# Altium schematic sheet Output13-21.SchDoc
size 594 x 420 mm; SheetNumber: 8; SheetTotal: 10; Обозначение документа: QFP output13-21; Общее количество листов: 10
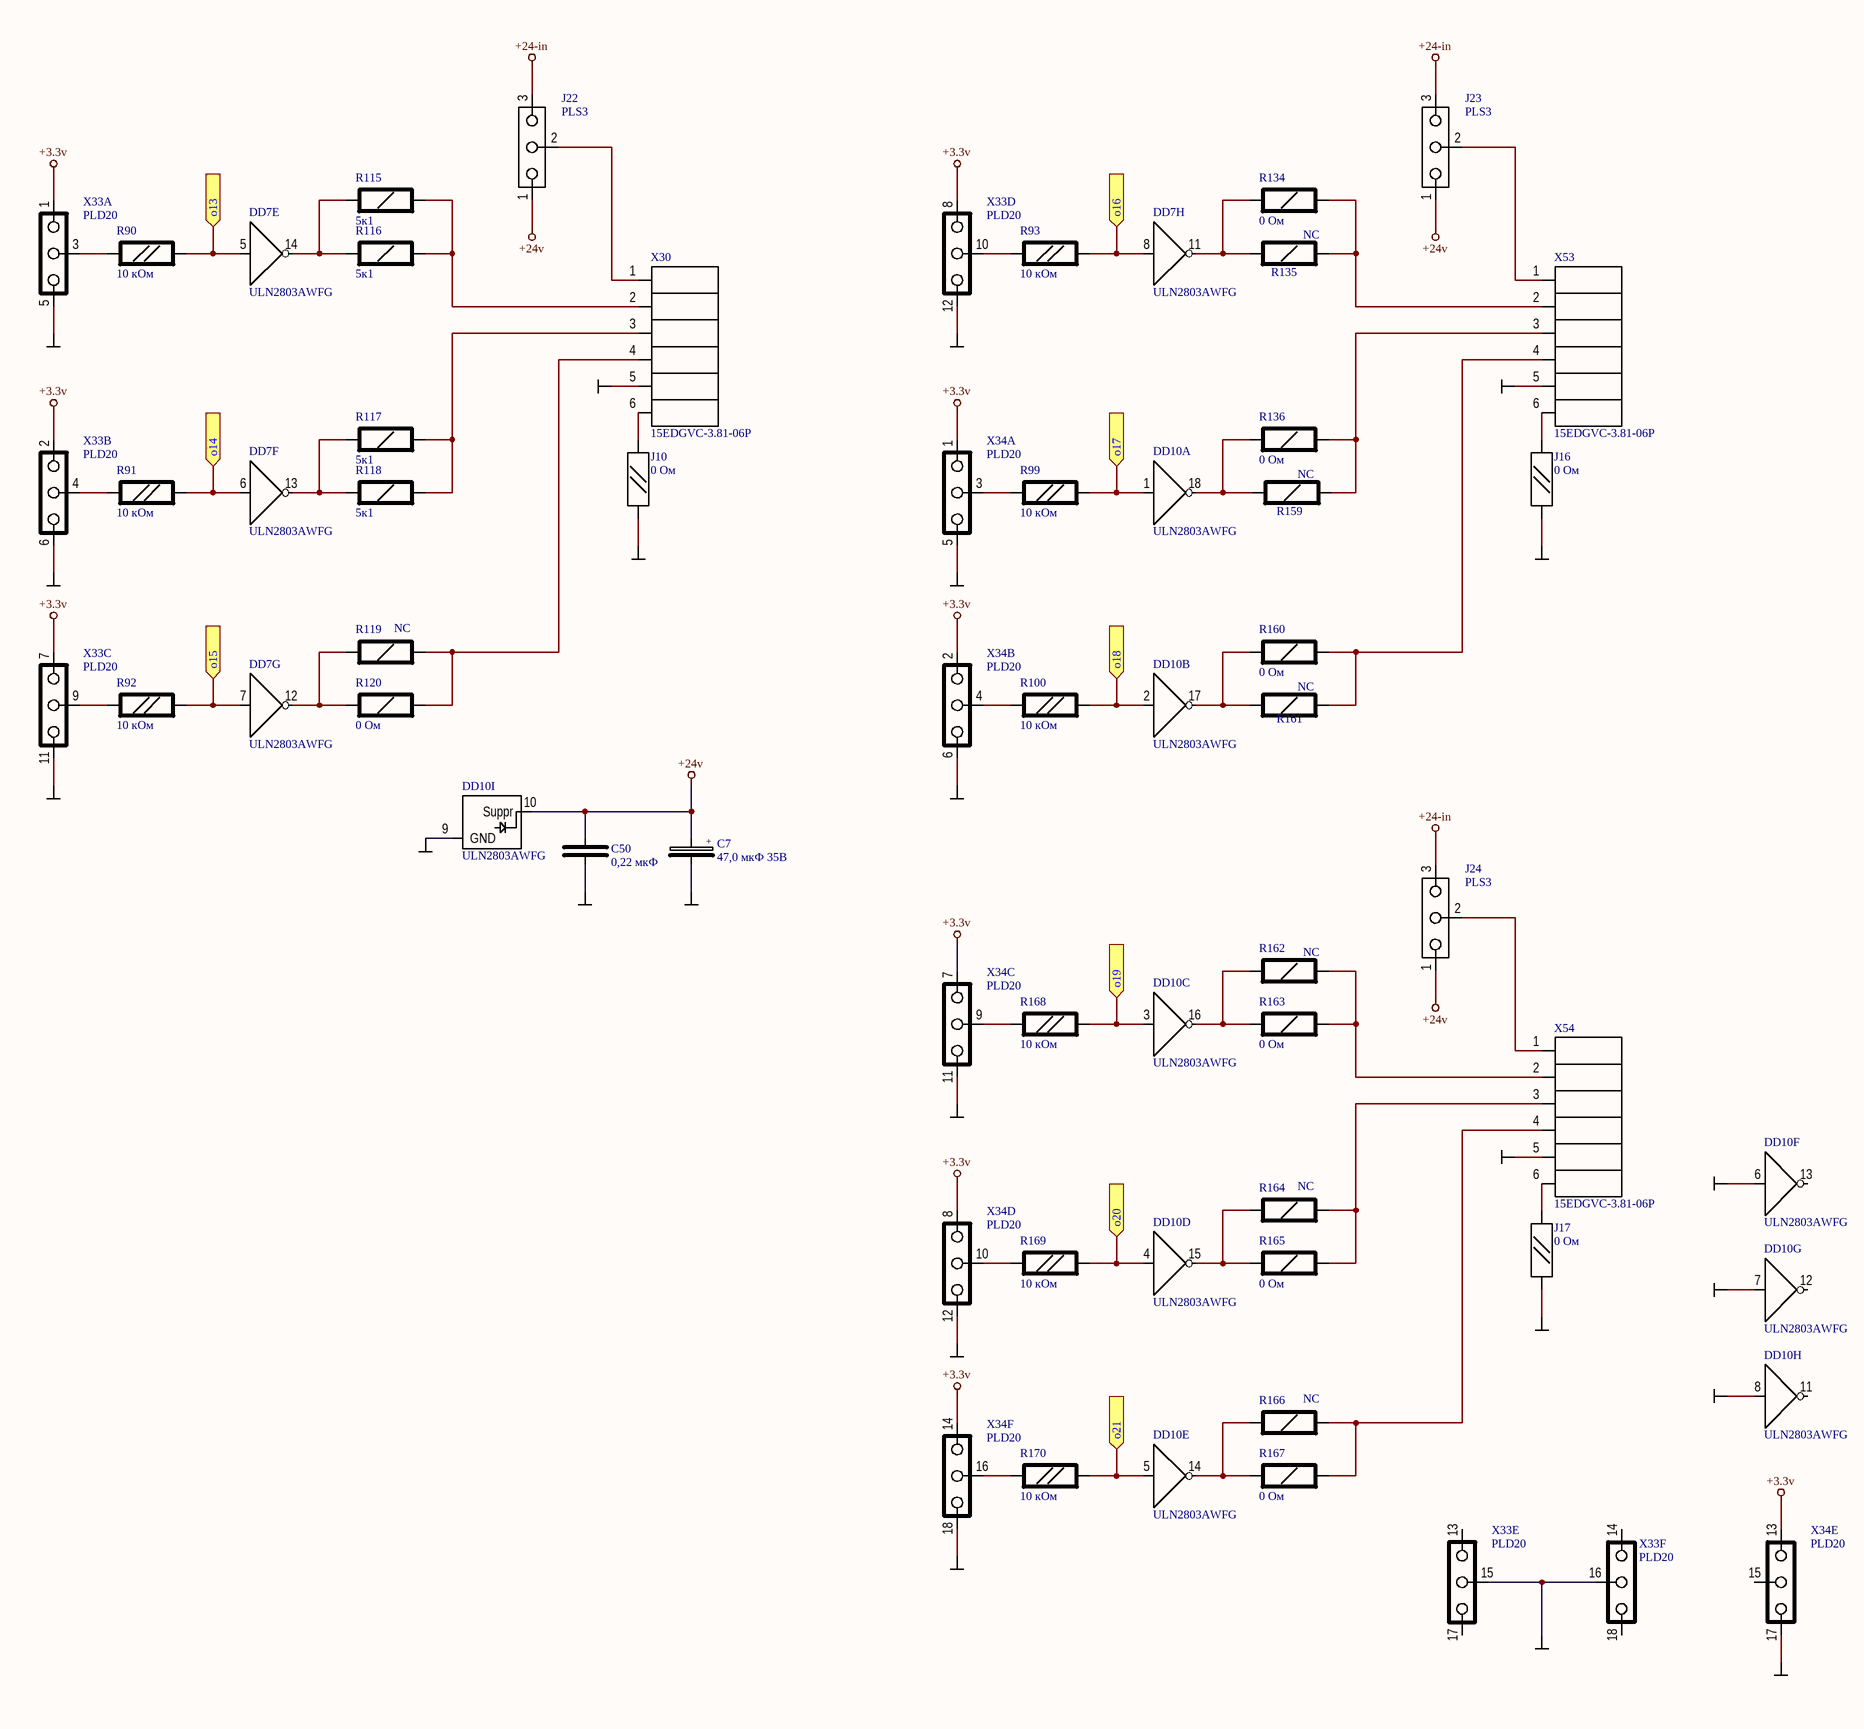
[diagram p0: Output13-21.SchDoc]

## Parts
C7  47,0 мкФ 35В  [cap6]
C50  0,22 мкФ  [SMD0805CAP]
DD7  ULN2803AWFG  [SOL18]  (parts E,F,G,H of 9)
DD10  ULN2803AWFG  [SOL18]  (parts A,B,C,D,E,F,G,H,I of 9)
J10  0 Ом  [SMD0805RES]
J16  0 Ом  [SMD0805RES]
J17  0 Ом  [SMD0805RES]
J22  PLS3  [HDR1X3]
J23  PLS3  [HDR1X3]
J24  PLS3  [HDR1X3]
R90  10 кОм  [SMD0805RES]
R91  10 кОм  [SMD0805RES]
R92  10 кОм  [SMD0805RES]
R93  10 кОм  [SMD0805RES]
R99  10 кОм  [SMD0805RES]
R100  10 кОм  [SMD0805RES]
R115  5к1  [RES1206]
R116  5к1  [RES1206]
R117  5к1  [RES1206]
R118  5к1  [RES1206]
R119  SolderOpton: NC  [RES1206]
R120  0 Ом  [RES1206]
R134  0 Ом  [RES1206]
R135  SolderOpton: NC  [RES1206]
R136  0 Ом  [RES1206]
R159  SolderOpton: NC  [RES1206]
R160  0 Ом  [RES1206]
R161  SolderOpton: NC  [RES1206]
R162  SolderOpton: NC  [RES1206]
R163  0 Ом  [RES1206]
R164  SolderOpton: NC  [RES1206]
R165  0 Ом  [RES1206]
R166  SolderOpton: NC  [RES1206]
R167  0 Ом  [RES1206]
R168  10 кОм  [SMD0805RES]
R169  10 кОм  [SMD0805RES]
R170  10 кОм  [SMD0805RES]
X30  15EDGVC-3.81-06P  [15EDGVC_081_6]
X33  PLD20  [pld2x10_1.27]  (parts A,B,C,D,E,F of 7)
X34  PLD20  [pld2x10_1.27]  (parts A,B,C,D,E,F of 7)
X53  15EDGVC-3.81-06P  [15EDGVC_081_6]
X54  15EDGVC-3.81-06P  [15EDGVC_081_6]

## Ports
o13 (in), o14 (in), o15 (in), o16 (in), o17 (in), o18 (in), o19 (in), o20 (in), o21 (in)

## Nets
+3.3v: X33.1 X33.2 X33.7 X33.8 X34.1 X34.2 X34.7 X34.8 X34.13 X34.14
+24-in: J22.3(Left) J23.3(Left) J24.3(Left)
+24v: C7.1(+) C50.1 DD10.10(Suppr) J22.1(Right) J23.1(Right) J24.1(Right)
GND: C7.2(-) C50.2 DD10.6(In) DD10.7(In) DD10.8(In) DD10.9(GND) J10.2 J16.2 J17.2 X30.5 X33.5 X33.6 X33.11 X33.12 X33.15 X33.16 X34.5 X34.6 X34.11 X34.12 X34.17 X34.18 X53.5 X54.5
o13: DD7.5(In) R90.1 ; port o13
o14: DD7.6(In) R91.1 ; port o14
o15: DD7.7(In) R92.1 ; port o15
o16: DD7.8(In) R93.1 ; port o16
o17: DD10.1(In) R99.1 ; port o17
o18: DD10.2(In) R100.1 ; port o18
o19: DD10.3(In) R168.1 ; port o19
o20: DD10.4(In) R169.1 ; port o20
o21: DD10.5(In) R170.1 ; port o21
NetDD7_11: DD7.11(OUT) R134.2 R135.2
NetDD7_12: DD7.12(OUT) R119.2 R120.2
NetDD7_13: DD7.13(OUT) R117.2 R118.2
NetDD7_14: DD7.14(OUT) R115.2 R116.2
NetDD10_14: DD10.14(OUT) R166.2 R167.2
NetDD10_15: DD10.15(OUT) R164.2 R165.2
NetDD10_16: DD10.16(OUT) R162.2 R163.2
NetDD10_17: DD10.17(OUT) R160.2 R161.2
NetDD10_18: DD10.18(OUT) R136.2 R159.2
NetJ10_1: J10.1 X30.6
NetJ16_1: J16.1 X53.6
NetJ17_1: J17.1 X54.6
NetJ22_2: J22.2(Cetnter) X30.1
NetJ23_2: J23.2(Cetnter) X53.1
NetJ24_2: J24.2(Cetnter) X54.1
NetR90_2: R90.2 X33.3
NetR91_2: R91.2 X33.4
NetR92_2: R92.2 X33.9
NetR93_2: R93.2 X33.10
NetR99_2: R99.2 X34.3
NetR100_2: R100.2 X34.4
NetR115_1: R115.1 R116.1 X30.2
NetR117_1: R117.1 R118.1 X30.3
NetR119_1: R119.1 R120.1 X30.4
NetR134_1: R134.1 R135.1 X53.2
NetR136_1: R136.1 R159.1 X53.3
NetR160_1: R160.1 R161.1 X53.4
NetR162_1: R162.1 R163.1 X54.2
NetR164_1: R164.1 R165.1 X54.3
NetR166_1: R166.1 R167.1 X54.4
NetR168_2: R168.2 X34.9
NetR169_2: R169.2 X34.10
NetR170_2: R170.2 X34.16

Not connected (* = marked no-connect by the designer): DD10 11(OUT) 12(OUT) 13(OUT); X33 13 14 17 18; X34 15

## Notes on the sheet
- Подп. и дата
- Инв. № дубл.
- Взам. инв. №
- Инв. № подл.
- Изм.
- Лист
- № докум.
- Подп.
- Дата
- Копировал
- Формат А2

## Library data of the parts
C7 = C_e: 5мм Электролитический конденсатор; SolderOption: Norm; Value: 47,0 мкФ 35В
C50 = C0805: Чип конденсатор 0805; Voltage: 50V; Vendor: Generic; Temp: Y5V; Tol: 20%; SolderOpton: Norm; Value: 0,22 мкФ; Price: 2
DD7 DD10 = ULN2803: Буфер 8-канальный; Vendor: Toshiba; Voltage: 50V; Bandwidth: 15MHz; SolderOption: Norm; Value: ULN2803AWFG; Price: 100
J10 J16 J17 = JR0805: SMD 0805 перемычка; SolderOption: Norm; Price: 2; Vendor: *; Value: 0 Ом
J22-J24 = PLS3: Джампер PLS3 2.54мм; SolderOption: Norm; Price: 1; Vendor: *; Value: PLS3
R90-R93 R99 R100 R168-R170 = R0805: Чип резистор 0805; Vendor: Generic; Tolerance: 5%; SolderOpton: Norm; Price: 2; Value: 10 кОм
R115-R118 R120 R134 R136 R160 R163 R165 R167 = R1206: Чип резистор 1206; Vendor: Generic; Tolerance: 5%; SolderOpton: Norm; Price: 2
  R115-R118: Value: 5к1
  R120 R134 R136 R160 R163 R165 R167: Value: 0 Ом
R119 R135 R159 R161 R162 R164 R166 = R1206: Чип резистор 1206; Vendor: Generic; Tolerance: 5%; Price: 2
X30 X53 X54 = 15EDGVC-3.81-06P: Вилка  6/3.81; Vendor: Degson; Current: 8А; Voltage: 2кВ; Price: 50; Value: 15EDGVC-3.81-06P
X33 X34 = PLD20: Вилка  PLD 20/1.27; Vendor: Confly; SolderOption: Norm; Price: 10; Value: PLD20